# EAGLE design I2C (EAGLE 9.6.2)

## Sheet 1 of 3
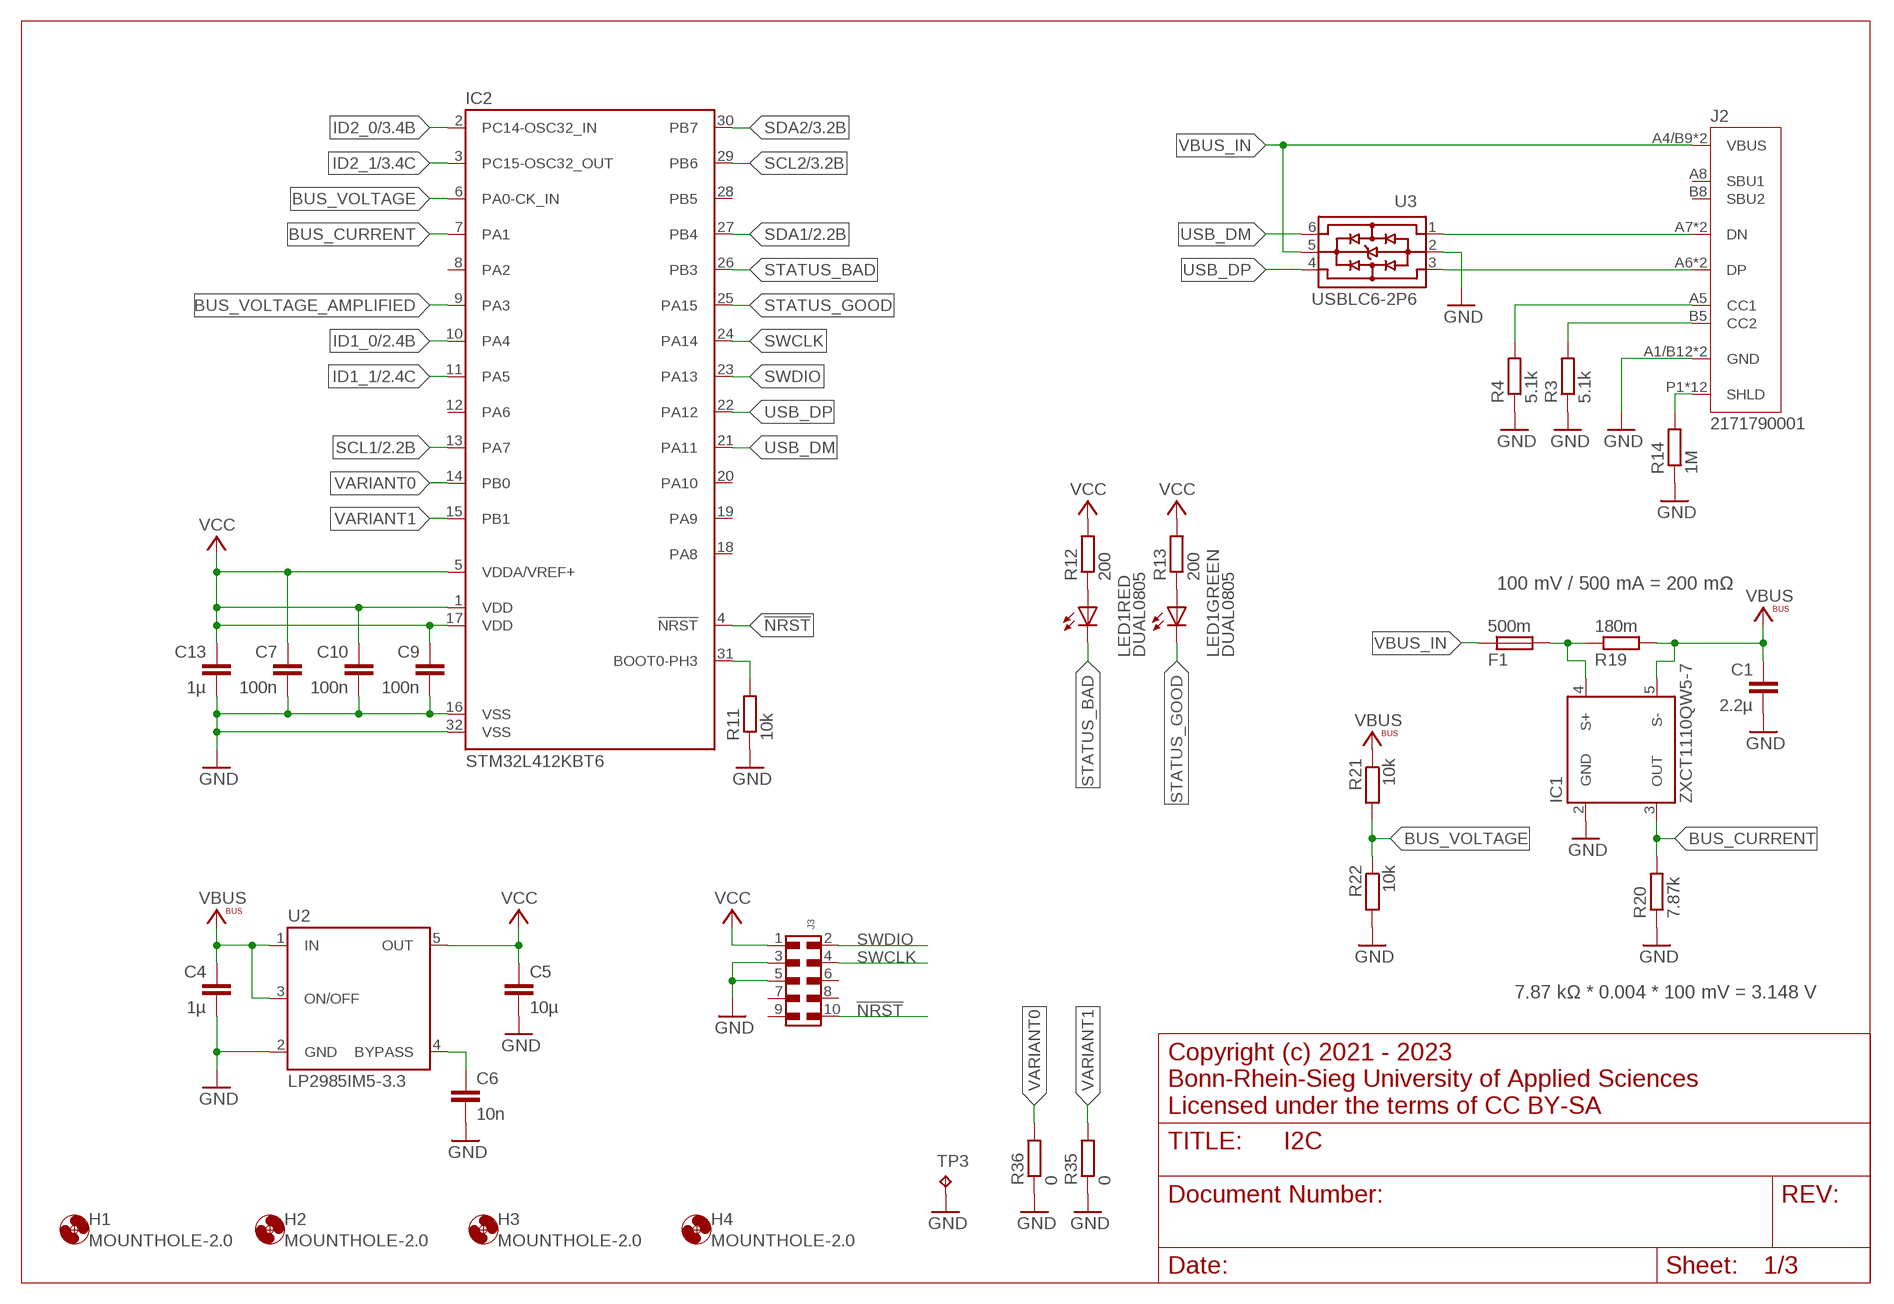
[diagram p0: schematic, sheet 1]

### Parts
C1  2.2µ  C-EUC0805  [C0805]
C4  1µ  C-EUC0805  [C0805]
C5  10µ  C-EUC0603  [C0603]
C6  10n  C-EUC0603  [C0603]
C7  100n  C-EUC0603  [C0603]
C9  100n  C-EUC0603  [C0603]
C10  100n  C-EUC0603  [C0603]
C13  1µ  C-EUC0603  [C0603]
F1  500m  FUSE0603  [R0603]
H1  MOUNTHOLE-2.0  [2.0]
H2  MOUNTHOLE-2.0  [2.0]
H3  MOUNTHOLE-2.0  [2.0]
H4  MOUNTHOLE-2.0  [2.0]
IC1  ZXCT1110QW5-7  [SOT23-5L]
IC2  STM32L412KBT6  [LQFP32]
J2  2171790001  [2171790001_MOL]
J3  6210XX21021_62101021021  [62101021021]
LED1  DUAL0805  [CHIPLEDX2]
R3  5.1k  R-EU_R0603  [R0603]
R4  5.1k  R-EU_R0603  [R0603]
R11  10k  R-EU_R0603  [R0603]
R12  200  R-EU_R0603  [R0603]
R13  200  R-EU_R0603  [R0603]
R14  1M  R-EU_R0603  [R0603]
R19  180m  R-EU_R0805  [R0805]
R20  7.87k  R-EU_R0603  [R0603]
R21  10k  R-EU_R0603  [R0603]
R22  10k  R-EU_R0603  [R0603]
R35  0  R-EU_R0603  [R0603]
R36  0  R-EU_R0603  [R0603]
TP3  TP3.8X2.03  [3.8X2.03]
U2  LP2985IM5-3.3  [SOT23-5]
U3  USBLC6-2P6  [SOT-666]

### Nets
!NRST: IC2.4(!NRST) J3.10
BUS_CURRENT: IC1.3(OUT) IC2.7(PA1) R20.2
BUS_VOLTAGE: IC2.6(PA0-CK_IN) R21.2 R22.1
BUS_VOLTAGE_AMPLIFIED: IC2.9(PA3)
GND: C1.2 C4.2 C5.2 C6.2 C7.2 C9.2 C10.2 C13.2 IC1.2(GND) IC2.16(VSS) IC2.32(VSS) J2.A1/B12(GND) J2.B1/A12(GND) J3.3 J3.5 R3.1 R4.1 R11.1 R14.1 R20.1 R22.2 R35.1 R36.1 TP3.TP U2.2(GND) U3.2 ; also sheet 2,3
ID1_0: IC2.10(PA4) ; also sheet 2
ID1_1: IC2.11(PA5) ; also sheet 2
ID2_0: IC2.2(PC14-OSC32_IN) ; also sheet 3
ID2_1: IC2.3(PC15-OSC32_OUT) ; also sheet 3
N$1: J2.P1(SHLD) J2.P2(SHLD) J2.P3(SHLD) J2.P4(SHLD) J2.S1(SHLD) J2.S2(SHLD) J2.S3(SHLD) J2.S4(SHLD) J2.S5(SHLD) J2.S6(SHLD) J2.S7(SHLD) J2.S8(SHLD) R14.2
N$4: J2.A6(DP) J2.B6(DP) U3.3
N$5: J2.A7(DN) J2.B7(DN) U3.1
N$6: J2.B5(CC2) R3.2
N$7: J2.A5(CC1) R4.2
N$8: C6.1 U2.4(BYPASS)
N$10: IC2.31(BOOT0-PH3) R11.2
N$11: LED1.A2(GREEN:A) R13.1
N$12: LED1.A1(RED:A) R12.1
N$18: F1.2 IC1.4(S+) R19.1
SCL1: IC2.13(PA7) ; also sheet 2
SCL2: IC2.29(PB6) ; also sheet 3
SDA1: IC2.27(PB4) ; also sheet 2
SDA2: IC2.30(PB7) ; also sheet 3
STATUS_BAD: IC2.26(PB3) LED1.C1(RED:C)
STATUS_GOOD: IC2.25(PA15) LED1.C2(GREEN:C)
SWCLK: IC2.24(PA14) J3.4
SWDIO: IC2.23(PA13) J3.2
USB_DM: IC2.21(PA11) U3.6
USB_DP: IC2.22(PA12) U3.4
VARIANT0: IC2.14(PB0) R36.2
VARIANT1: IC2.15(PB1) R35.2
VBUS: C1.1 C4.1 IC1.5(S-) R19.2 R21.1 U2.1(IN) U2.3(ON/OFF) ; also sheet 2,3
VBUS_IN: F1.1 J2.A4/B9(VBUS) J2.B4/A9(VBUS) U3.5
VCC: C5.1 C7.1 C9.1 C10.1 C13.1 IC2.1(VDD) IC2.5(VDDA/VREF+) IC2.17(VDD) J3.1 R12.2 R13.2 U2.5(OUT) ; also sheet 2,3
Unconnected: IC2.8(PA2) IC2.12(PA6) IC2.18(PA8) IC2.19(PA9) IC2.20(PA10) IC2.28(PB5) J2.A8(SBU1) J2.B8(SBU2) J3.6 J3.7 J3.8 J3.9

### Notes on the sheet
- 100 mV / 500 mA = 200 mΩ
- 7.87 kΩ * 0.004 * 100 mV = 3.148 V
- Copyright (c) 2021 - 2023
  Bonn-Rhein-Sieg University of Applied Sciences
  Licensed under the terms of CC BY-SA

## Sheet 2 of 3: Isolator 1
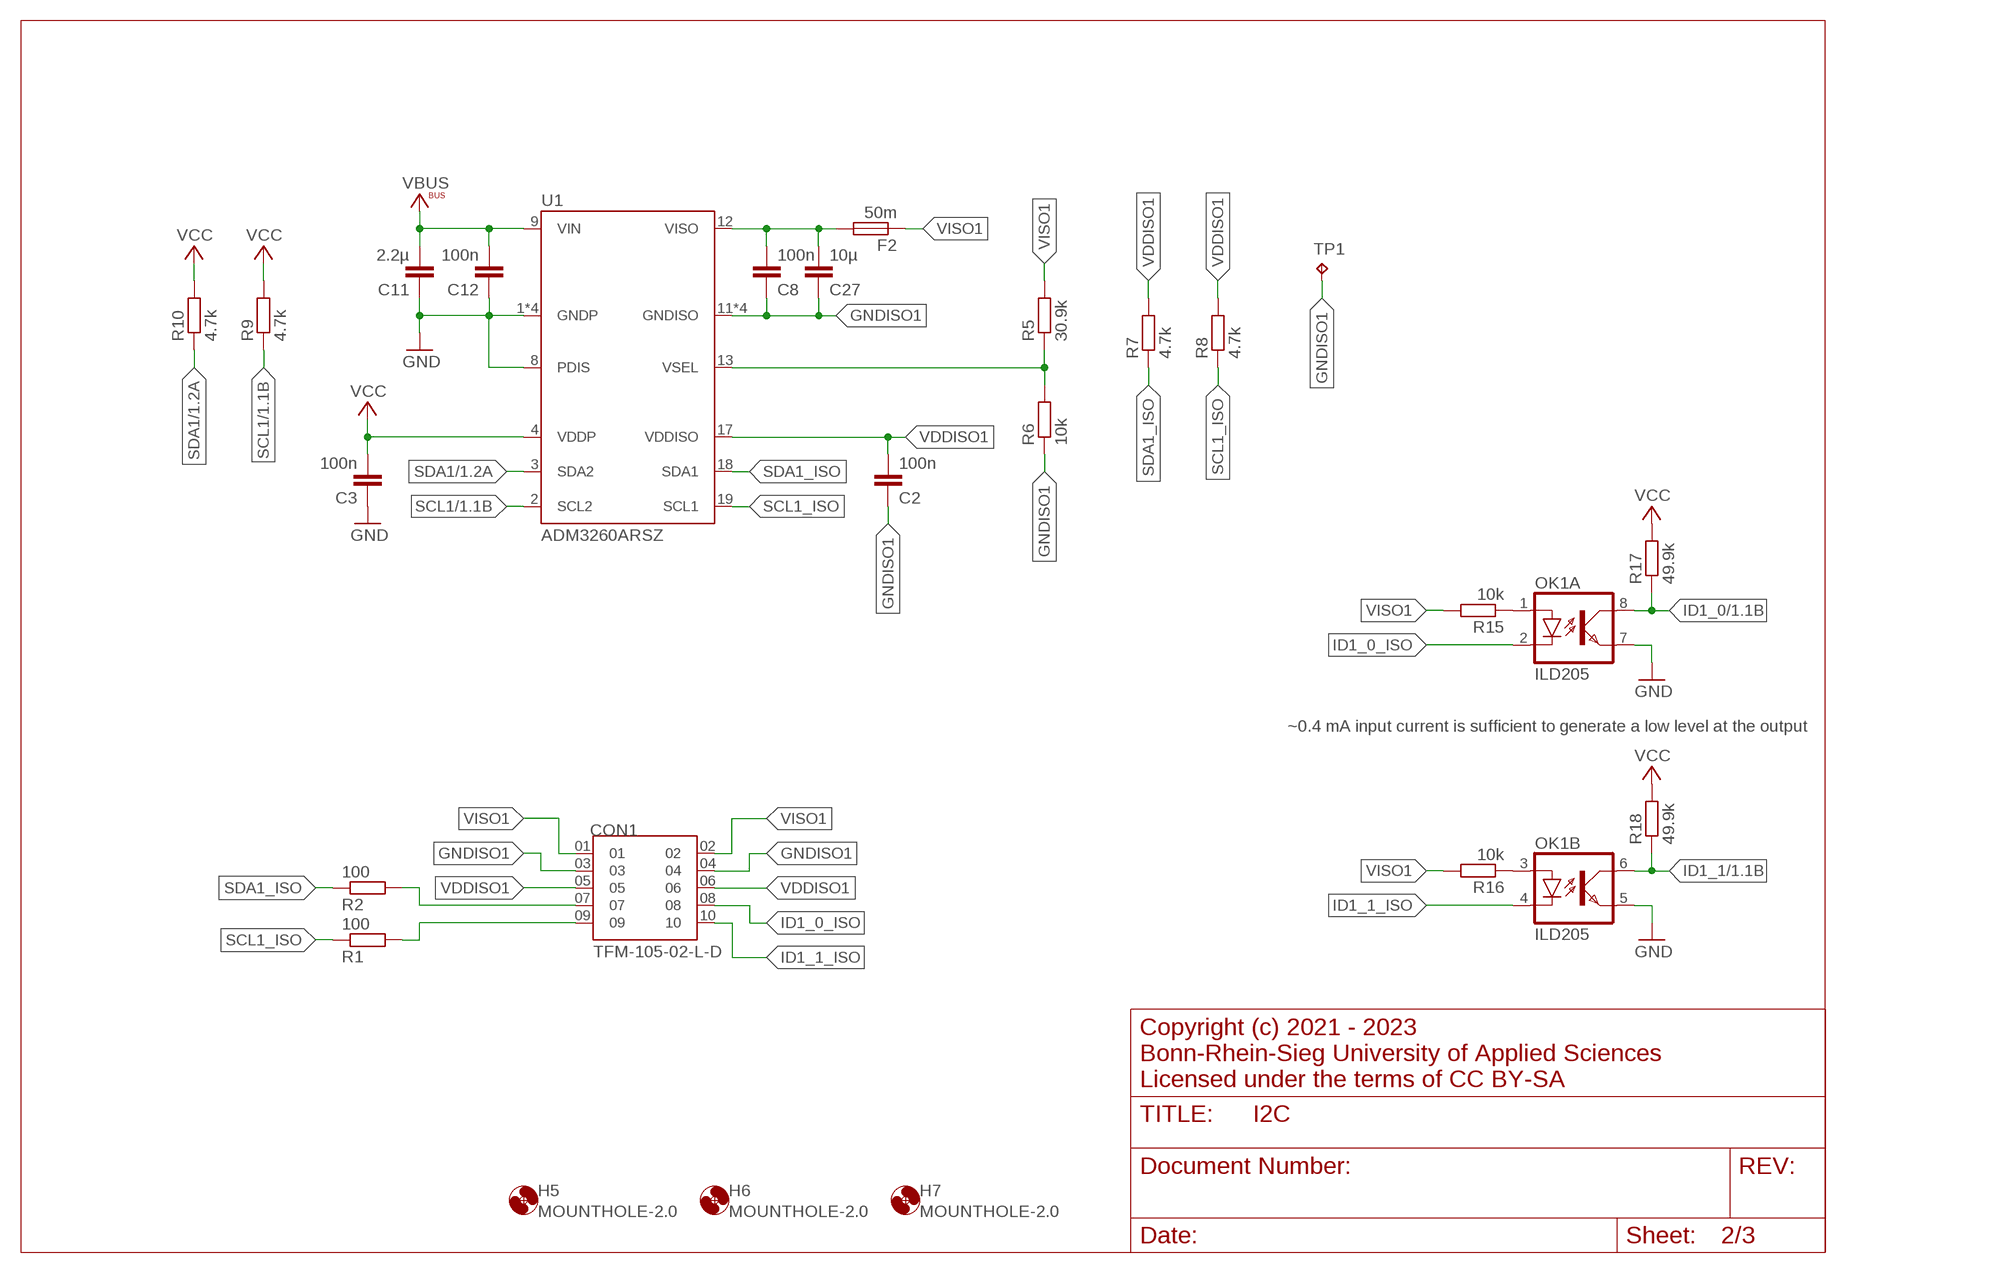
[diagram p1: schematic, sheet 2]

### Parts
C2  100n  C-EUC0603  [C0603]
C3  100n  C-EUC0603  [C0603]
C8  100n  C-EUC0603  [C0603]
C11  2.2µ  C-EUC0603  [C0603]
C12  100n  C-EUC0603  [C0603]
C27  10µ  C-EUC0603  [C0603]
CON1  TFM-105-02-L-D  [SAMTEC_TFM-105-02-L-D]
F2  50m  FUSE0603  [R0603]
H5  MOUNTHOLE-2.0  [2.0]
H6  MOUNTHOLE-2.0  [2.0]
H7  MOUNTHOLE-2.0  [2.0]
OK1  ILD205  [SOIC08]
R1  100  R-EU_R0603  [R0603]
R2  100  R-EU_R0603  [R0603]
R5  30.9k  R-EU_R0603  [R0603]
R6  10k  R-EU_R0603  [R0603]
R7  4.7k  R-EU_R0603  [R0603]
R8  4.7k  R-EU_R0603  [R0603]
R9  4.7k  R-EU_R0603  [R0603]
R10  4.7k  R-EU_R0603  [R0603]
R15  10k  R-EU_R0603  [R0603]
R16  10k  R-EU_R0603  [R0603]
R17  49.9k  R-EU_R0603  [R0603]
R18  49.9k  R-EU_R0603  [R0603]
TP1  TP3.8X2.03  [3.8X2.03]
U1  ADM3260ARSZ  [SSOP20]

### Nets
GND: C3.1 C11.1 C12.1 OK1.5(B:EMIT) OK1.7(A:EMIT) U1.1(GNDP) U1.5(GNDP) U1.7(GNDP) U1.8(PDIS) U1.10(GNDP) ; also sheet 1,3
GNDISO1: C2.1 C8.1 C27.1 CON1.03 CON1.04 R6.1 TP1.TP U1.11(GNDISO) U1.14(GNDISO) U1.16(GNDISO) U1.20(GNDISO)
ID1_0: OK1.8(A:COL) R17.1 ; also sheet 1
ID1_0_ISO: CON1.08 OK1.2(A:C)
ID1_1: OK1.6(B:COL) R18.1 ; also sheet 1
ID1_1_ISO: CON1.10 OK1.4(B:C)
N$3: CON1.09 R1.2
N$9: R5.1 R6.2 U1.13(VSEL)
N$13: CON1.07 R2.2
N$14: OK1.3(B:A) R16.1
N$15: OK1.1(A:A) R15.1
N$16: C8.2 C27.2 F2.2 U1.12(VISO)
SCL1: R9.1 U1.2(SCL2) ; also sheet 1
SCL1_ISO: R1.1 R8.1 U1.19(SCL1)
SDA1: R10.1 U1.3(SDA2) ; also sheet 1
SDA1_ISO: R2.1 R7.1 U1.18(SDA1)
VBUS: C11.2 C12.2 U1.9(VIN) ; also sheet 1,3
VCC: C3.2 R9.2 R10.2 R17.2 R18.2 U1.4(VDDP) ; also sheet 1,3
VDDISO1: C2.2 CON1.05 CON1.06 R7.2 R8.2 U1.17(VDDISO)
VISO1: CON1.01 CON1.02 F2.1 R5.2 R15.2 R16.2

### Notes on the sheet
- ~0.4 mA input current is sufficient to generate a low level at the output
- Copyright (c) 2021 - 2023
  Bonn-Rhein-Sieg University of Applied Sciences
  Licensed under the terms of CC BY-SA

## Sheet 3 of 3: Isolator 2
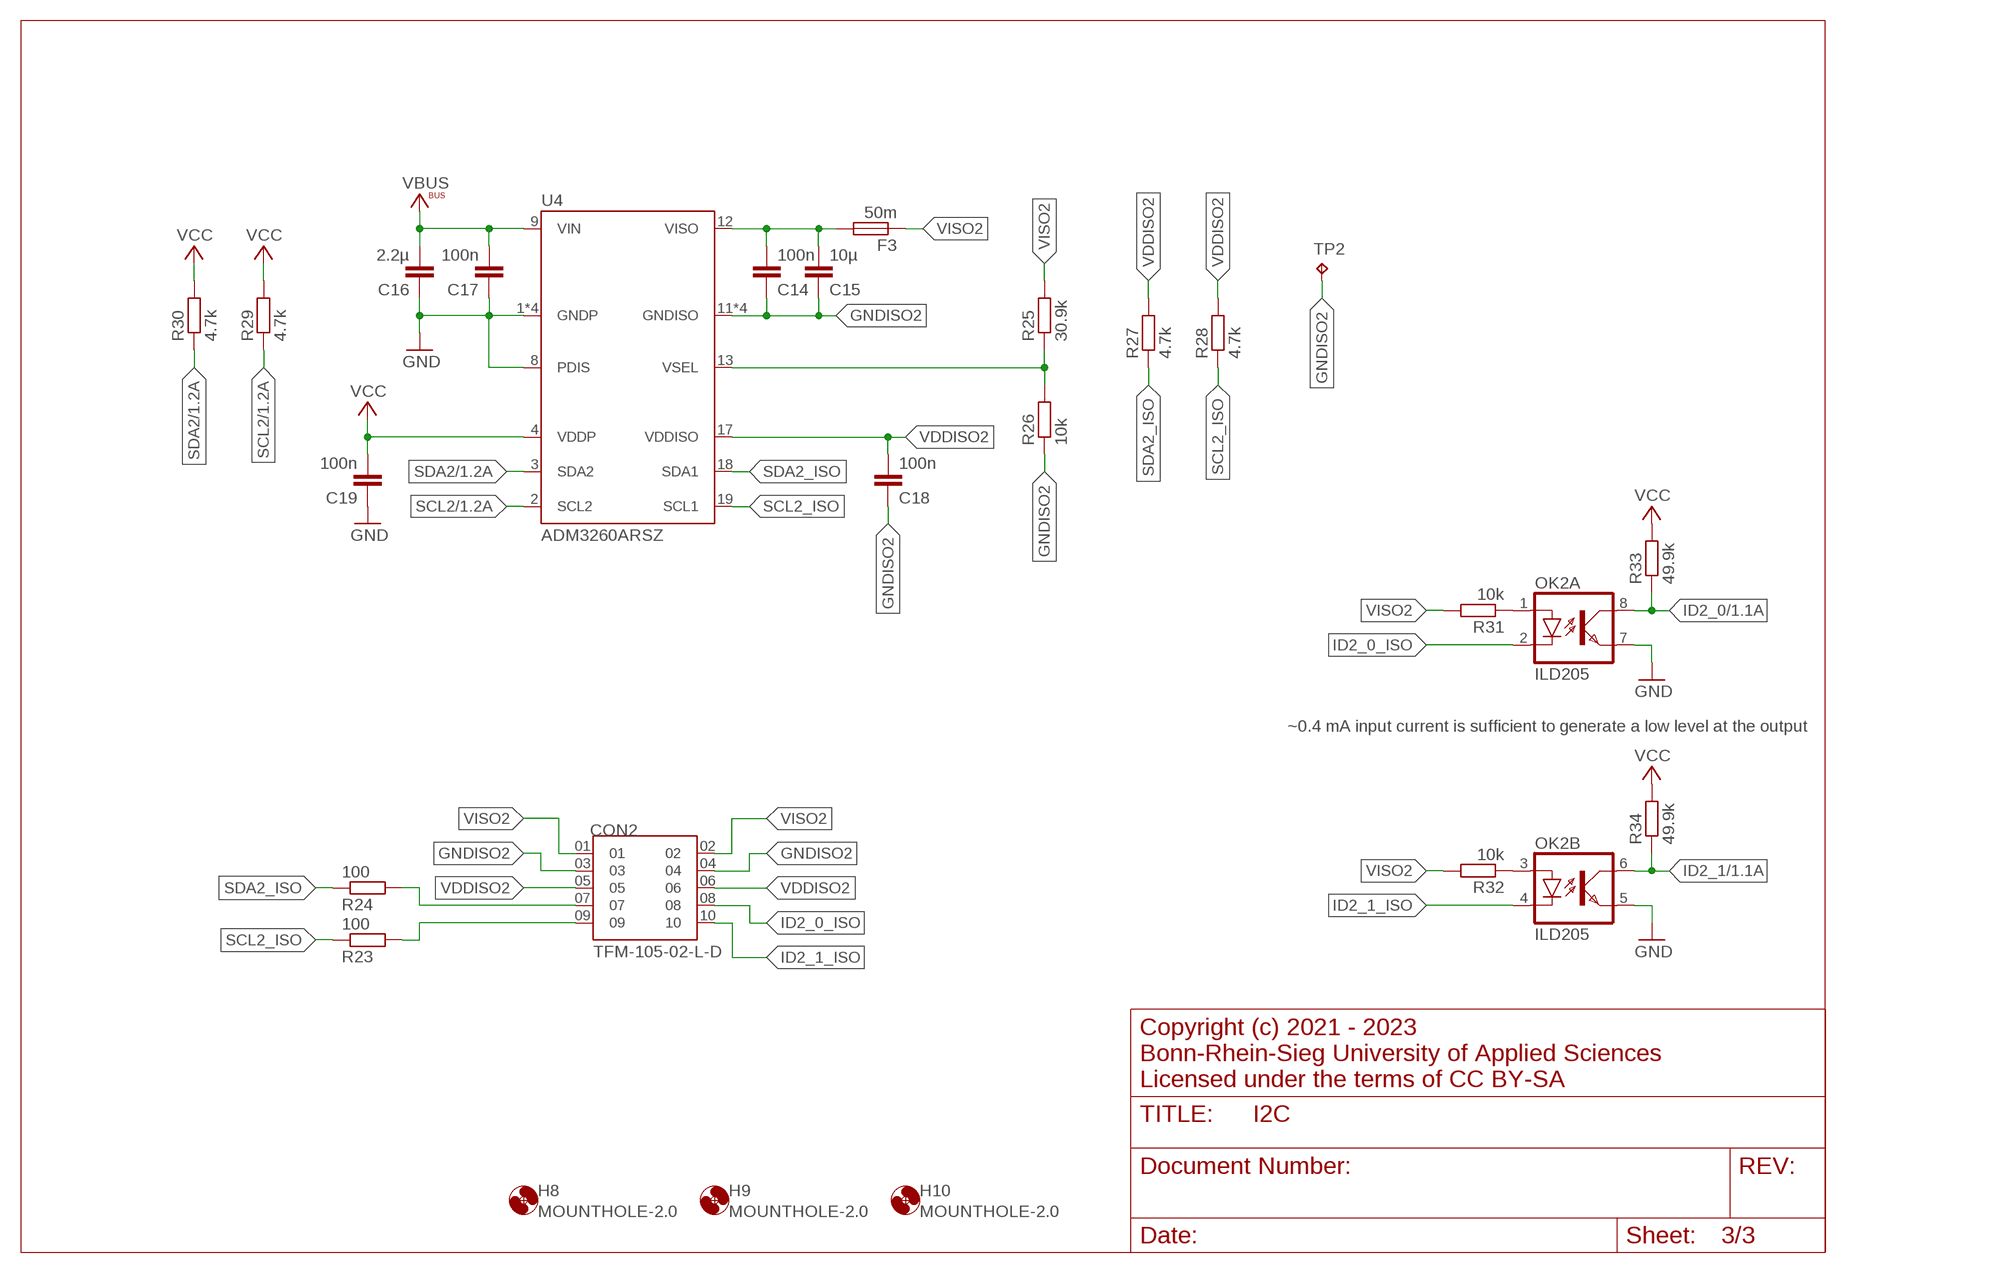
[diagram p2: schematic, sheet 3]

### Parts
C14  100n  C-EUC0603  [C0603]
C15  10µ  C-EUC0603  [C0603]
C16  2.2µ  C-EUC0603  [C0603]
C17  100n  C-EUC0603  [C0603]
C18  100n  C-EUC0603  [C0603]
C19  100n  C-EUC0603  [C0603]
CON2  TFM-105-02-L-D  [SAMTEC_TFM-105-02-L-D]
F3  50m  FUSE0603  [R0603]
H8  MOUNTHOLE-2.0  [2.0]
H9  MOUNTHOLE-2.0  [2.0]
H10  MOUNTHOLE-2.0  [2.0]
OK2  ILD205  [SOIC08]
R23  100  R-EU_R0603  [R0603]
R24  100  R-EU_R0603  [R0603]
R25  30.9k  R-EU_R0603  [R0603]
R26  10k  R-EU_R0603  [R0603]
R27  4.7k  R-EU_R0603  [R0603]
R28  4.7k  R-EU_R0603  [R0603]
R29  4.7k  R-EU_R0603  [R0603]
R30  4.7k  R-EU_R0603  [R0603]
R31  10k  R-EU_R0603  [R0603]
R32  10k  R-EU_R0603  [R0603]
R33  49.9k  R-EU_R0603  [R0603]
R34  49.9k  R-EU_R0603  [R0603]
TP2  TP3.8X2.03  [3.8X2.03]
U4  ADM3260ARSZ  [SSOP20]

### Nets
GND: C16.1 C17.1 C19.1 OK2.5(B:EMIT) OK2.7(A:EMIT) U4.1(GNDP) U4.5(GNDP) U4.7(GNDP) U4.8(PDIS) U4.10(GNDP) ; also sheet 1,2
GNDISO2: C14.1 C15.1 C18.1 CON2.03 CON2.04 R26.1 TP2.TP U4.11(GNDISO) U4.14(GNDISO) U4.16(GNDISO) U4.20(GNDISO)
ID2_0: OK2.8(A:COL) R33.1 ; also sheet 1
ID2_0_ISO: CON2.08 OK2.2(A:C)
ID2_1: OK2.6(B:COL) R34.1 ; also sheet 1
ID2_1_ISO: CON2.10 OK2.4(B:C)
N$2: R25.1 R26.2 U4.13(VSEL)
N$17: CON2.09 R23.2
N$19: CON2.07 R24.2
N$20: OK2.3(B:A) R32.1
N$21: OK2.1(A:A) R31.1
N$22: C14.2 C15.2 F3.2 U4.12(VISO)
SCL2: R29.1 U4.2(SCL2) ; also sheet 1
SCL2_ISO: R23.1 R28.1 U4.19(SCL1)
SDA2: R30.1 U4.3(SDA2) ; also sheet 1
SDA2_ISO: R24.1 R27.1 U4.18(SDA1)
VBUS: C16.2 C17.2 U4.9(VIN) ; also sheet 1,2
VCC: C19.2 R29.2 R30.2 R33.2 R34.2 U4.4(VDDP) ; also sheet 1,2
VDDISO2: C18.2 CON2.05 CON2.06 R27.2 R28.2 U4.17(VDDISO)
VISO2: CON2.01 CON2.02 F3.1 R25.2 R31.2 R32.2

### Notes on the sheet
- ~0.4 mA input current is sufficient to generate a low level at the output
- Copyright (c) 2021 - 2023
  Bonn-Rhein-Sieg University of Applied Sciences
  Licensed under the terms of CC BY-SA

## Library data of the parts
C1 C4-C6 = rcl:C-EU: CAPACITOR, European symbol; SPICEPREFIX: C
C2 C3 C7-C19 C27 = rcl:C-EU: CAPACITOR, European symbol
CON1 CON2 = TFM-10x-02-L-D:TFM-105-02-L-D
F1-F3 = Fuse0603:FUSE: Surface mount fuse
H1-H10 = MountHoles:MOUNTHOLE-2.0
IC1 = ZXCT11xx:ZXCT1110: LOW POWER HIGH-SIDE CURRENT MONITORS
IC2 = STM32:STM32L412K*?: Ultra-low-power ARM Cortex-M4 32-bit MCU+FPU, 100DMIPS, up to 128KB Flash, 40KB SRAM, analog, ext. SMPS
J2 = USB-C:2171790001; COPYRIGHT: Copyright (C) 2021 Ultra Librarian. All rights reserved.; DIGI-KEY_PART_NUMBER_1: 900-2171790001TR-ND; DIGI-KEY_PART_NUMBER_2: 900-2171790001CT-ND; DIGI-KEY_PART_NUMBER_3: 900-2171790001DKR-ND; MANUFACTURER_PART_NUMBER: 2171790001; MFR_NAME: Molex Connector Corporation
J3 = WR-PHD:6210XX21021_62101021021: WR-PHD 1.27 mm SMT Dual Pin Header, H=3.80 mm ARTICLE PROPERTIES: Pins:4;​ 8;​ 10;​ 14;​ 16;​ 20;​ 28;​ 40;​ 44;​ 50 KIND PROPERTIES: Pitch：1.27 mm Quality Class:3 as per CECC 75 301-802 Rows：Dual Gender：Pin Header Type：Straight MATERIAL PROPERTIES: Insulator Material :PA9T Insulator Flammability Rating:UL94 V-0 Contact Material:Copper Alloy Contact Plating:Gold Contact Type:Stamped GENERAL INFORMATION Operating Temperature:-40 up to +105 °C Compliance:Lead free / RoHS ELECTRICAL PROPERTIES: Rated Current:1 A;​ max. IR1:1 A Withstanding Voltage:500 V (AC) Contact Resistance:20 mΩ RISO:1000 MΩ CERTIFICATION UL Approval:E323964 PACKAGING PROPERTIES Packaging:Tube Packaging Unit:228;​ 114;​ 91;​ 65;​ 57;​ 45;​ 32;​ 23;​ 20;​ 18 <https://katalog.we-online.com/media/images/v2/o33195v209%20Family_WR-PDH_621xxx21021.jpg> Details see: https://katalog.we-online.com/en/em/PHD_1_27_SMT_DUAL_PIN_HEADER_6210XX21021 Updated by Yingchun,Shan 2019-10-25 2019 (C) Würth Elektronik; DATASHEET-URL: https://katalog.we-online.com/em/datasheet/62101021021.pdf; GENDER: Pin Header; IR: 1A; MATES: WR-PHD 1.27mm Dual Socket Header/SMT Dual Socket Header,H=4.5mm/SMT Dual Socket Header,H=4.5mm(Reel); PACKAGING: Tube; PART-NUMBER: 62101021021; PINS: 10; ROWS: Dual; TYPE: Straight
LED1 = DualLED:DUAL0805: Kingbright APHBM2012SURKCGKC (www.digikey.de/product-detail/de/kingbright/APHBM2012SURKCGKC/754-1093-1-ND/1747810)
OK1 OK2 = optocoupler:ILD2*: Siemens ILD205/206/207/211/213/217 DUAL PHOTOTRANSISTOR SMALL OUTLINE SURFACE MOUNT OPTOCOUPLER Source: 153385-da-01-en-Optocoupler_ILD205-T.pdf; MF: VISHAY/TELEFUNKEN; MPN: ILD205T; OC_FARNELL: 1469512; OC_NEWARK: 20H8678
R1-R34 = rcl:R-EU_: RESISTOR, European symbol; SPICEPREFIX: R
R35 R36 = rcl:R-EU_: RESISTOR, European symbol
TP1-TP3 = Testpoints:TP: KEYSTONE SURFACE MOUNT TEST POINTS
U1 U4 = ADM3260:ADM3260: Hot Swappable, Dual I2C Isolators with Integrated DC-to-DC Converter
U2 = LP2985:LP2985?-*: LP2985-N Micropower 150-mA Low-Noise Ultra-Low-Dropout Regulator in a SOT-23 Package Designed for Use With Very Low ESR Output Capacitors
U3 = USBLC6-2:USBLC6-2: Very low capacitance ESD protection

## Board
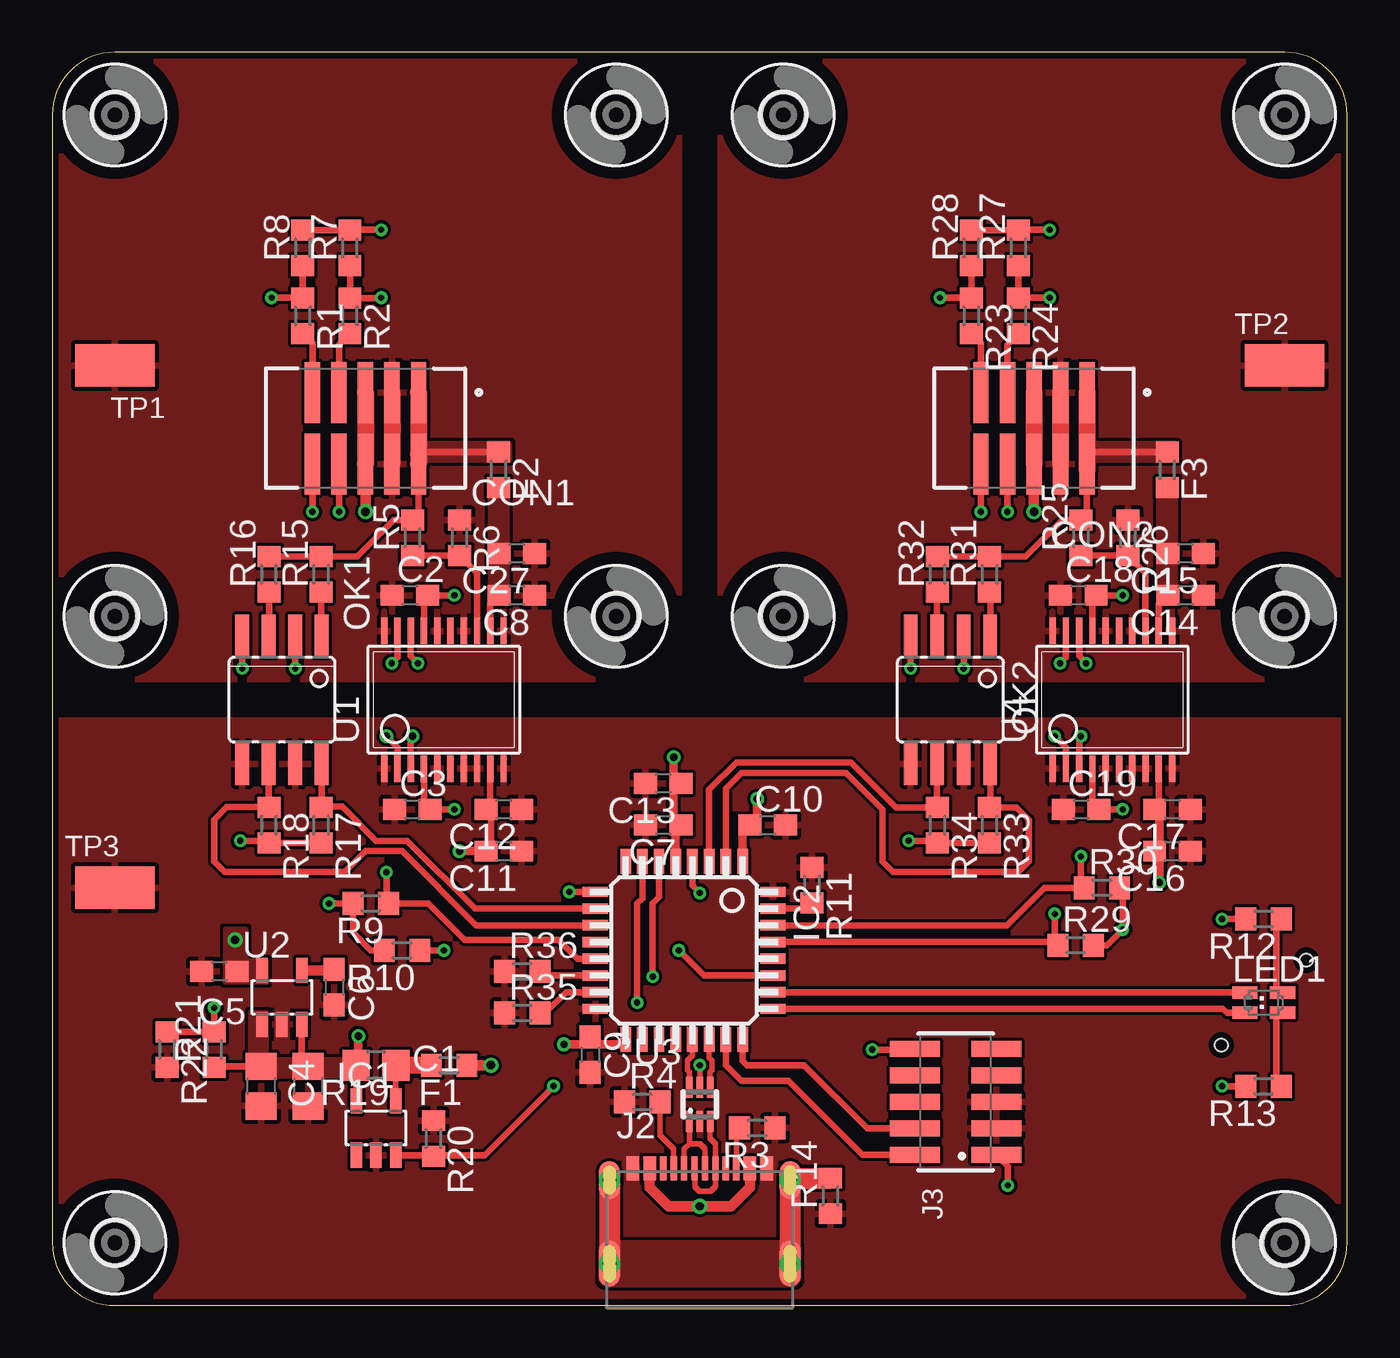
[diagram p3: board, top side]
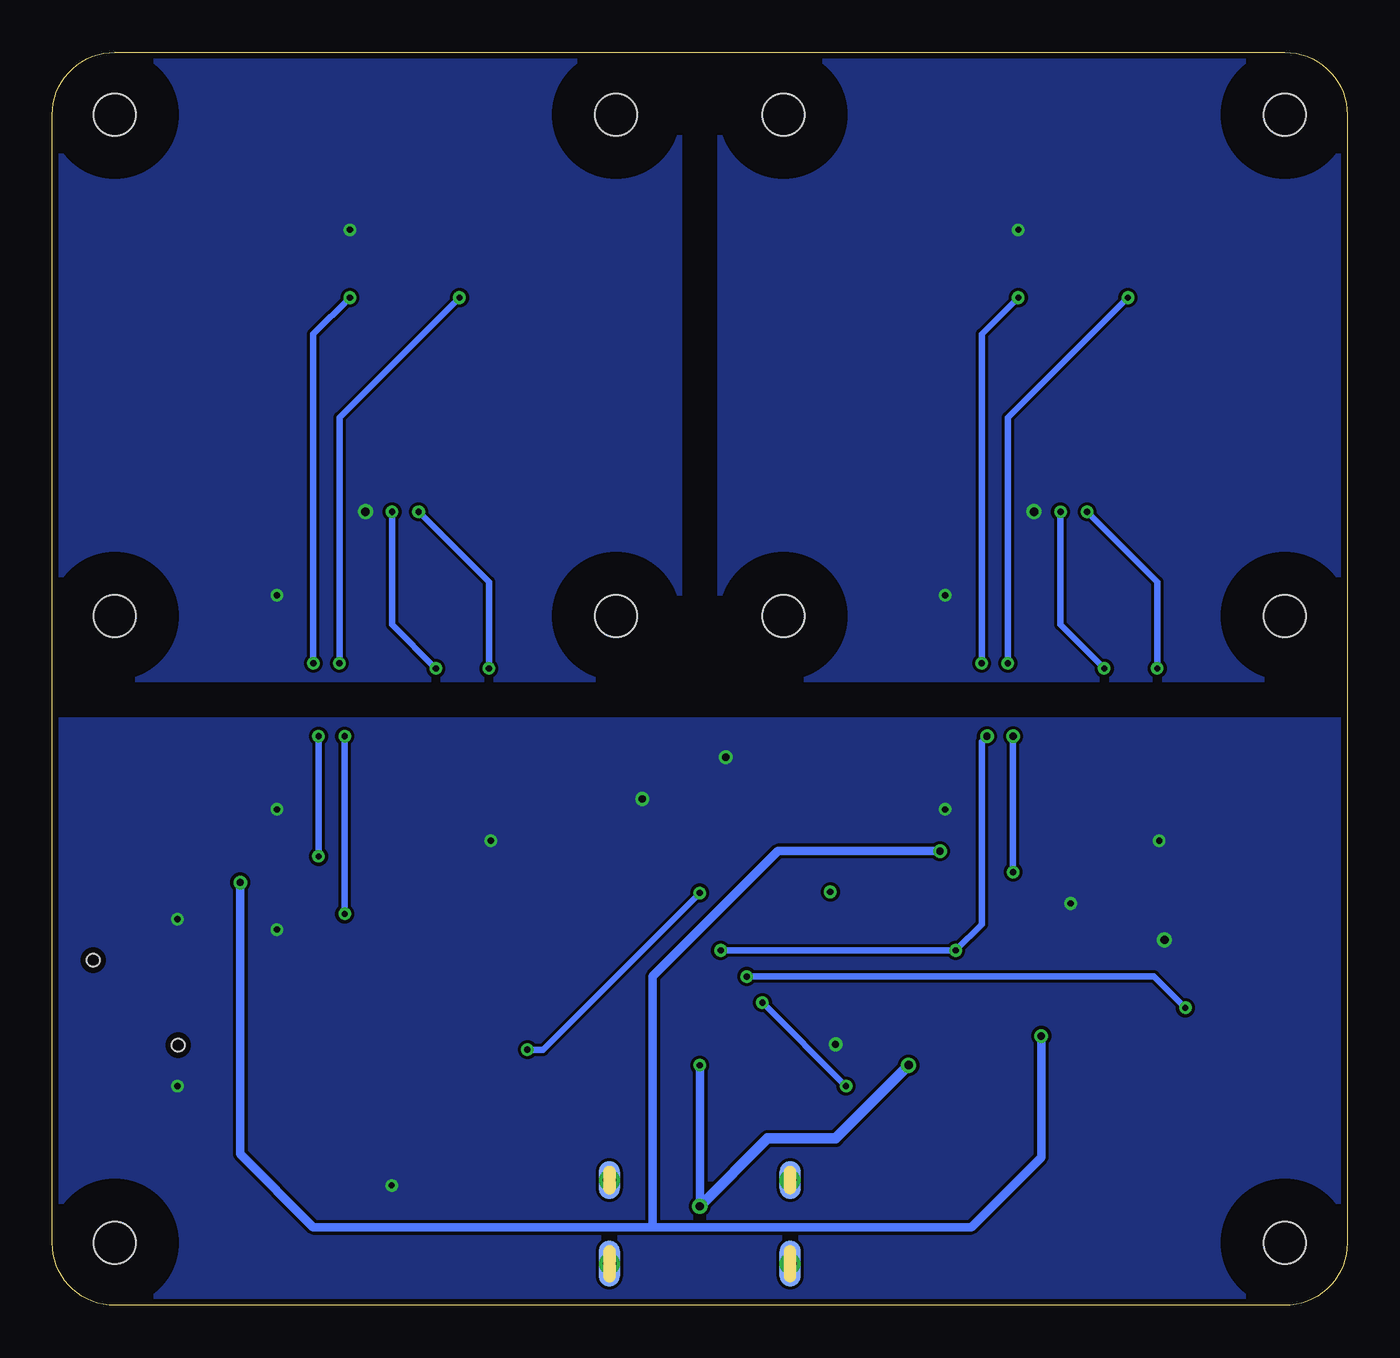
[diagram p4: board, bottom side, seen from below]

Size 62 x 60 mm. Coordinates in mm from the lower left corner, seen from the top.
Outline: 0,3 arc90 3,0 59,0 arc90 62,3 62,57 arc90 59,60 3,60 arc90 0,57 0,3
Copper layers (1*16): Top 0.035mm / dielectric 1.5mm / Bottom 0.035mm
Design rules "PCB-POOL Standard": minimum track width 0.15mm, minimum drill 0.3mm, track to track 0.15mm, track to pad 0.15mm, pad to pad 0.15mm, via to via 0.15mm, smd to smd 0.15mm, copper to edge 0.3mm, drill to drill 0.2mm, minimum pad ring 0.2mm, minimum via ring 0.15mm, stop-mask expansion 0.075mm, vias tented up to drill 0mil, thermal gap 0.2mm
Holes 0.61 mm at 60.03,16.53 55.97,12.47

### Footprints (pad centres in the part's own frame; a part is rotated, then mirrored left to right if it is on the bottom)
C0805 = smd 1.3 x 1.5: 1 -0.95,0; 2 0.95,0
C0603 = smd 1.1 x 1: 1 -0.85,0; 2 0.85,0
SAMTEC_TFM-105-02-L-D = smd 0.74 x 2.92: 01 -2.54,-1.715; 02 -2.54,1.715; 03 -1.27,-1.715; 04 -1.27,1.715; 05 0,-1.715; 06 0,1.715; 07 1.27,-1.715; 08 1.27,1.715; 09 2.54,-1.715; 10 2.54,1.715
R0603 = smd 1 x 1.1: 1 -0.85,0; 2 0.85,0
2.0 = hole 2: 0,0
SOT23-5L = smd 0.55 x 1.2: 1 -0.95,-1.3; 2 0,-1.3; 3 0.95,-1.3; 4 0.95,1.3; 5 -0.95,1.3
LQFP32 = smd 0.5 x 1.2: 1 -2.8,-4.25; 2 -2,-4.25; 3 -1.2,-4.25; 4 -0.4,-4.25; 5 0.4,-4.25; 6 1.2,-4.25; 7 2,-4.25; 8 2.8,-4.25; 17 2.8,4.25; 18 2,4.25; 19 1.2,4.25; 20 0.4,4.25; 21 -0.4,4.25; 22 -1.2,4.25; 23 -2,4.25; 24 -2.8,4.25 | smd 1.2 x 0.5: 9 4.25,-2.8; 10 4.25,-2; 11 4.25,-1.2; 12 4.25,-0.4; 13 4.25,0.4; 14 4.25,1.2; 15 4.25,2; 16 4.25,2.8; 25 -4.25,2.8; 26 -4.25,2; 27 -4.25,1.2; 28 -4.25,0.4; 29 -4.25,-0.4; 30 -4.25,-1.2; 31 -4.25,-2; 32 -4.25,-2.8
2171790001_MOL = smd 0.6 x 1.15: A1/B12 -3.2,2.575; A4/B9 -2.4,2.575; B1/A12 3.2,2.575; B4/A9 2.4,2.575 | smd 0.3 x 1.15: A5 -1.25,2.575; A6 -0.25,2.575; A7 0.25,2.575; A8 1.25,2.575; B5 1.75,2.575; B6 0.75,2.575; B7 -0.75,2.575; B8 -1.75,2.575 | drill 0.6 pad 1: P1 -4.32,2; P2 4.32,2; P3 -4.32,-2; P4 4.32,-2 | smd 1 x 1.8: S1 -4.32,2; S2 4.32,2 | smd 1 x 2.2: S3 -4.32,-2; S4 4.32,-2 | smd 1 x 2.2 bottom: S5 -4.32,-2; S6 4.32,-2 | smd 1 x 1.8 bottom: S7 4.32,2; S8 -4.32,2
62101021021 = smd 0.75 x 2.4: 1 -2.54,-1.95; 2 -2.54,1.95; 3 -1.27,-1.95; 4 -1.27,1.95; 5 0,-1.95; 6 0,1.95; 7 1.27,-1.95; 8 1.27,1.95; 9 2.54,-1.95; 10 2.54,1.95
CHIPLEDX2 = smd 0.6 x 1.2: A1 -0.475,0.9; A2 0.475,0.9; C1 -0.475,-0.9; C2 0.475,-0.9
SOIC08 = smd 0.66 x 2.032: 1 -1.905,-3.073; 2 -0.635,-3.073; 3 0.635,-3.073; 4 1.905,-3.073; 5 1.905,3.073; 6 0.635,3.073; 7 -0.635,3.073; 8 -1.905,3.073
R0805 = smd 1.3 x 1.5: 1 -0.95,0; 2 0.95,0
3.8X2.03 = smd 3.8 x 2.03: TP 0,0
SSOP20 = smd 0.305 x 1.245: 1 -2.857,-3.302; 2 -2.222,-3.302; 3 -1.587,-3.302; 4 -0.952,-3.302; 5 -0.317,-3.302; 6 0.318,-3.302; 7 0.953,-3.302; 8 1.588,-3.302; 9 2.223,-3.302; 10 2.858,-3.302; 11 2.858,3.302; 12 2.223,3.302; 13 1.588,3.302; 14 0.953,3.302; 15 0.318,3.302; 16 -0.317,3.302; 17 -0.952,3.302; 18 -1.587,3.302; 19 -2.222,3.302; 20 -2.857,3.302
SOT23-5 = smd 0.55 x 1.2: 1 -0.95,-1.3; 2 0,-1.3; 3 0.95,-1.3; 4 0.95,1.3; 5 -0.95,1.3
SOT-666 = smd 0.3 x 1: 1 -0.5,-0.81; 2 0,-0.81; 3 0.5,-0.81; 4 0.5,0.81; 5 0,0.81; 6 -0.5,0.81

### Placement (x,y rotation side)
C1  12.25,10.5 270 top
C2  17.12,34 0 top
C3  17.25,23.75 0 top
C4  10,10.5 270 top
C5  8,16 180 top
C6  13.5,15.25 270 top
C7  29.25,23 180 top
C8  22.25,34 180 top
C9  25.75,12 270 top
C10  34.25,23 0 top
C11  21.62,21.75 180 top
C12  21.62,23.75 180 top
C13  29.25,25 180 top
C14  54.25,34 180 top
C15  54.25,36 180 top
C16  53.62,21.75 180 top
C17  53.62,23.75 180 top
C18  49.12,34 0 top
C19  49.25,23.75 0 top
C27  22.25,36 180 top
CON1  15,42 180 top
CON2  47,42 180 top
F1  19,11.5 180 top
F2  21.38,40 270 top
F3  53.38,40 270 top
H1  3,3 0 top
H2  59,3 0 top
H3  59,57 0 top
H4  3,57 0 top
H5  3,33 0 top
H6  27,57 0 top
H7  27,33 0 top
H8  35,33 0 top
H9  59,33 0 top
H10  35,57 0 top
IC1  15.5,8.5 0 top
IC2  30.25,17 180 top
J2  31,4 0 top
J3  43.25,9.75 90 top
LED1  58,14.5 270 top
OK1  11,29 180 top
OK2  43,29 180 top
R1  12,47.38 270 top
R2  14.25,47.38 270 top
R3  33.75,8.5 180 top
R4  28.25,9.75 0 top
R5  17.25,36.75 90 top
R6  19.5,36.75 270 top
R7  14.25,50.62 90 top
R8  12,50.62 90 top
R9  15.25,19.25 180 top
R10  16.75,17 180 top
R11  36.38,20.12 270 top
R12  58,18.5 180 top
R13  58,10.5 180 top
R14  37.25,5.25 90 top
R15  12.88,35 90 top
R16  10.38,35 90 top
R17  12.88,23 270 top
R18  10.38,23 270 top
R19  15.5,11.5 180 top
R20  18.25,8 270 top
R21  7.75,12.25 90 top
R22  5.5,12.25 270 top
R23  44,47.38 270 top
R24  46.25,47.38 270 top
R25  49.25,36.75 90 top
R26  51.5,36.75 270 top
R27  46.25,50.62 90 top
R28  44,50.62 90 top
R29  49,17.25 0 top
R30  50.25,20 0 top
R31  44.88,35 90 top
R32  42.38,35 90 top
R33  44.88,23 270 top
R34  42.38,23 270 top
R35  22.5,14 0 top
R36  22.5,16 0 top
TP1  3,45 180 top
TP2  59,45 0 top
TP3  3,20 0 top
U1  18.75,29 0 top
U2  11,14.75 0 top
U3  31,9.62 0 top
U4  50.75,29 0 top

### Tracks (layer width: path | path; a pad name or v marks a point on that pad's centre or on a via)
!NRST  (via drill 0.3)
  Top 0.305: IC2.4 30.65,20.1 v31,19.75 | v39.25,12.25 41.26,12.25 J3.10
  Bottom 0.305: v39.25,12.25 38.5,12.25 v31,19.75
BUS_CURRENT  (via drill 0.3)
  Top 0.305: IC1.3 18.2,7.2 | 18.2,7.2 R20.2 | IC2.7 28.25,19.5 28,19.25 v28,14.5 | v24,10.5 20.7,7.2 18.2,7.2
  Bottom 0.305: v28,14.5 v24,10.5
BUS_VOLTAGE  (via drill 0.3)
  Top 0.305: R22.1 R21.2 v7.75,14.25 | IC2.6 29.05,19.55 28.75,19.25 v28.75,15.75
  Bottom 0.305: v7.75,14.25 9.25,15.75 v28.75,15.75
BUS_VOLTAGE_AMPLIFIED  (via drill 0.3)
  Top 0.305: IC2.9 24.8,19.8 v24.75,19.8
GND
  pour Top (rank 2): 0,3 0,28 62,28 62,3 arc-90 59,0 3,0 arc-90
  pour Top (no thermals): 10.75,12.5 11.25,12.5 11.25,14.5 12.75,14.5 12.75,15 9.25,15 9.25,14.5 10.75,14.5
  pour Top (no thermals): 30.12,9.75 31.88,9.75 31.88,9.25 31.12,9.25 31.12,8.88 30.88,8.88 30.88,9.25 30.12,9.25
  pour Top (no thermals): 28,5.62 28,7.5 27.38,7.5 27.38,5.62
  pour Top (no thermals): 34.62,5.62 34.62,7.5 34,7.5 34,5.62
GNDISO1
  Top 0.813: CON1.03 CON1.04
  pour Top (rank 2): 0,57 arc-90 3,60 30,60 30,30 0,30
GNDISO2
  Top 0.813: CON2.03 CON2.04
  pour Top (rank 2): 32,30 62,30 62,57 arc90 59,60 32,60
ID1_0
  Top 0.305: OK1.8 12.9,23.88 | 12.9,23.88 R17.1 | IC2.10 20.25,19 17,22.25 15.5,22.25 13.87,23.88 12.9,23.88
ID1_0_ISO  (via drill 0.3)
  Top 0.305: CON1.08 v13.73,38 | OK1.2 v11.63,30.5
  Bottom 0.305: v11.63,30.5 13.73,32.59 v13.73,38
ID1_1
  Top 0.305: OK1.6 10.37,23.86 | 10.37,23.86 R18.1 | IC2.11 20.3,18.2 16.75,21.75 15,21.75 14,20.75 8.25,20.75 7.75,21.25 7.75,23.25 8.36,23.86 10.37,23.86
ID1_1_ISO  (via drill 0.3)
  Top 0.305: OK1.4 v9.1,30.5 | CON1.10 v12.46,38
  Bottom 0.305: v9.1,30.5 9.1,34.63 v12.46,38
ID2_0
  Top 0.305: OK2.8 44.91,23.88 R33.1 46.15,23.85 46.75,23.25 46.75,21.25 46.25,20.75 40.25,20.75 39.75,21.25 39.75,23.75 38,25.5 33,25.5 32.25,24.75 IC2.2
ID2_0_ISO  (via drill 0.3)
  Top 0.305: OK2.2 v43.63,30.5 | CON2.08 v45.73,38
  Bottom 0.305: v43.63,30.5 45.73,32.59 v45.73,38
ID2_1
  Top 0.305: OK2.6 42.37,23.86 R34.1 40.4,23.85 38.25,26 32.75,26 31.45,24.7 IC2.3
ID2_1_ISO  (via drill 0.3)
  Top 0.305: OK2.4 v41.09,30.5 | CON2.10 v44.46,38
  Bottom 0.305: v41.09,30.5 41.09,34.63 v44.46,38
N$1
  Top 1.016: J2.S8 J2.S5 | J2.S6 J2.S7 35.42,6.1 R14.2
  pour Top (no thermals): 26.62,1.38 35.38,1.38 35.38,2.62 26.62,2.62
N$2
  Top 0.305: R25.1 R26.2 52.34,35.06 U4.13
N$3
  Top 0.305: CON1.09 12.46,46.06 R1.2
N$4
  Top 0.254: U3.3 31.5,8 31.75,7.75 J2.B6 31.75,5.71 31.52,5.47 30.98,5.47 30.77,5.68 30.77,6.55 J2.A6
N$5
  Top 0.254: U3.1 30.5,7.75 | 30.5,7.75 30.25,7.5 J2.B7 | J2.A7 31.25,7.5 31,7.75 30.5,7.75
N$6
  Top 0.254: J2.B5 32.75,8.35 R3.2
N$7
  Top 0.254: J2.A5 29.75,7.5 29.1,8.15 R4.2
N$8
  Top 0.508: U2.4 13.45,16.05 C6.1
N$9
  Top 0.305: R5.1 R6.2 20.34,35.06 U1.13
N$10
  Top 0.305: IC2.31 36.1,19 R11.2
N$11
  Top 0.305: LED1.A2 58.6,13.72 58.6,10.75 R13.1
N$12
  Top 0.305: LED1.A1 58.6,15.28 58.6,18.25 R12.1
N$13
  Top 0.305: CON1.07 13.73,46.01 R2.2
N$14
  Top 0.305: R16.1 10.38,32.08 OK1.3
N$15
  Top 0.305: R15.1 12.88,32.1 OK1.1
N$16
  Top 0.305: U1.12 20.97,33.57 C8.2
  pour Top (no thermals): 21,33.75 21.75,33.75 21.75,39.5 21,39.5
N$17
  Top 0.305: CON2.09 44.46,46.06 R23.2
N$18
  Top 0.254: IC1.4 R19.1
  Top 0.813: F1.2 R19.1
N$19
  Top 0.305: CON2.07 45.73,46.01 R24.2
N$20
  Top 0.305: OK2.3 42.37,34.14 R32.1
N$21
  Top 0.305: OK2.1 44.91,34.12 R31.1
N$22
  Top 0.305: U4.12 52.97,33.57 C14.2
  pour Top (no thermals): 53.75,33.75 53.75,39.5 53,39.5 53,33.75
SCL1  (via drill 0.3, 0.35)
  Top 0.305: v16,20.75 16,19.75 16.3,19.45 R9.1 18,19.25 19.75,17.5 24.25,17.5 25.15,16.6 IC2.13 | v16,27.25 16.53,26.72 U1.2
  Bottom 0.305: v16,27.25 v16,20.75
SCL1_ISO  (via drill 0.3)
  Top 0.305: R8.1 R1.1 11.97,48.25 v10.5,48.25 | U1.19 16.53,31.03 v16.25,30.75
  Bottom 0.305: v16.25,30.75 16.25,42.5 v10.5,48.25
SCL2  (via drill 0.3)
  Top 0.305: IC2.29 48,17.4 | R29.1 48,17.4 | 48,17.4 v48,18.75 | v48,27.25 48.53,26.72 U4.2
  Bottom 0.305: v48,18.75 v48,27.25
SCL2_ISO  (via drill 0.3)
  Top 0.305: R28.1 R23.1 43.98,48.25 v42.5,48.25 | U4.19 48.53,31.03 v48.25,30.75
  Bottom 0.305: v48.25,30.75 48.25,42.5 v42.5,48.25
SDA1  (via drill 0.3, 0.35)
  Top 0.305: IC2.27 31.2,15.8 v30,17 | v18.75,17 R10.1 | v17.25,27.25 17.16,27.16 U1.3
  Bottom 0.305: v30,17 v18.75,17 17.5,18.25 17.5,27 v17.25,27.25
SDA1_ISO  (via drill 0.3)
  Top 0.305: R7.1 R2.1 15.72,48.23 v15.75,48.25 | U1.18 17.16,31.09 v17.5,30.75
  Bottom 0.305: v17.5,30.75 17.5,46.5 v15.75,48.25
SDA2  (via drill 0.3)
  Top 0.305: IC2.30 45.7,18.2 47.5,20 R30.1 49.25,20.15 v49.25,21.5 | v49.25,27.25 49.16,27.16 U4.3
  Bottom 0.305: v49.25,27.25 v49.25,21.5
SDA2_ISO  (via drill 0.3)
  Top 0.305: R27.1 R24.1 46.27,48.25 v47.75,48.25 | U4.18 49.16,31.09 v49.5,30.75
  Bottom 0.305: v49.5,30.75 49.5,46.5 v47.75,48.25
STATUS_BAD
  Top 0.305: IC2.26 57.08,15 LED1.C1
STATUS_GOOD
  Top 0.305: IC2.25 56.05,14.2 56.25,14 57.08,14 LED1.C2
SWCLK
  Top 0.305: IC2.24 33.05,11.7 33.25,11.5 36,11.5 39.02,8.48 J3.4
SWDIO
  Top 0.305: IC2.23 32.25,11.5 33,10.75 35.25,10.75 38.79,7.21 J3.2
USB_DM
  Top 0.254: IC2.21 30.65,11.97 30.42,11.74 30.42,11.26 30.5,11.18 U3.6
USB_DP
  Top 0.254: IC2.22 31.45,11.87 31.58,11.74 31.58,11.26 31.5,11.18 U3.4
VARIANT0
  Top 0.305: IC2.14 23.55,15.8 R36.2
VARIANT1
  Top 0.305: IC2.15 24.6,15 23.6,14 R35.2
VBUS  (via drill 0.35)
  Top 0.254: IC1.5 R19.2
  Top 0.305: C4.1 7.8,11.45 R21.1 | U4.9 52.97,23.95 C17.2 | U1.9 20.97,23.95 C12.2 21,23.52 21,21.98 C11.2 | U2.3 11.95,11.75 C1.1
  Top 0.406: R19.2 14.65,11.6 v14.65,12.9 | C17.2 53,23.52 53,21.98 C16.2 53,21.52 v53,20.25 | v19.5,21.75 C11.2
  Bottom 0.406: v53,20.25 53,7.25 49.5,3.75 33.25,3.75 | 33.25,3.75 18,3.75 14.65,7.1 v14.65,12.9 | v19.5,21.75 27.25,21.75 33.25,15.75 33.25,3.75
  pour Top (no thermals): 15,11 9.5,11 9.5,14 10.25,14 10.25,11.75 15,11.75
VBUS_IN  (via drill 0.3, 0.4)
  Top 0.254: U3.5 v31,11.5
  Top 0.508: J2.B4/A9 33.4,5.65 32.5,4.75 v31,4.75 29.5,4.75 28.6,5.65 J2.A4/B9 | v21,11.5 F1.1
  Bottom 0.406: v31,11.5 v31,4.75
  Bottom 0.508: v31,4.75 27.75,8 24.5,8 v21,11.5
VCC  (via drill 0.3, 0.35, 0.4)
  Top 0.305: C9.1 26.1,12.5 | v56,18.5 R12.2 | R13.2 v56,10.5 | J3.1 45.75,6.66 v45.75,5.75 | R33.2 R34.2 42.27,22.25 v41,22.25 | R17.2 R18.2 10.28,22.25 v9,22.25 | U4.4 49.8,24.05 C19.2 v51.25,23.75 | U1.4 17.8,24.05 C3.2 v19.25,23.75 | R29.2 50.5,17.25 v51.25,18 51.25,19.85 R30.2 | R10.2 15.25,17 14.4,17.85 R9.2 v13.25,19.25
  Top 0.406: IC2.17 27.2,12.5 26.1,12.5 | IC2.5 29.85,22.75 C7.1 29.75,23.35 29.75,24.65 C13.1 29.75,25.35 v29.75,26.25 | IC2.1 33.05,22.65 C10.1 33.75,23.35 v33.75,24.25 | C9.1 25.4,12.5 v24.5,12.5
  other vias: 8.75,17.5
  pour Bottom (rank 2): 0,28 0,3 arc90 3,0 59,0 arc90 62,3 62,28
  pour Top (no thermals): 8.3,15.5 8.3,18 9.25,18 9.25,16.5 10.25,16.5 10.25,15.5
VDDISO1  (via drill 0.3, 0.4)
  Top 0.305: U1.17 17.8,33.82 C2.2 v19.25,34 | R8.2 R7.2 14.28,51.5 v15.75,51.5
  Top 0.508: CON1.06 v15,38
  Top 0.813: CON1.05 CON1.06
  pour Bottom (rank 2): 0,57 0,30 30,30 30,60 3,60 arc90
VDDISO2  (via drill 0.3, 0.4)
  Top 0.305: U4.17 49.8,33.82 C18.2 v51.25,34 | R28.2 R27.2 46.27,51.5 v47.75,51.5
  Top 0.508: CON2.06 v47,38
  Top 0.813: CON2.05 CON2.06
  pour Bottom: 32,60 59,60 arc-90 62,57 62,30 32,30
VISO1
  Top 0.305: CON1.02 17.54,37.89 R5.2 16.35,37.6 14.6,35.85 R15.2 R16.2 | F2.1 17.64,40.85 17.54,40.75
  Top 0.813: CON1.01 17.54,40.75 CON1.02
  pour Top (no thermals): 21.88,41.25 17.5,41.25 17.5,40.5 21.88,40.5
VISO2
  Top 0.305: CON2.02 49.54,40 49.54,37.89 R25.2 48.35,37.6 46.6,35.85 R31.2 R32.2 | F3.1 49.89,40.85 49.54,40.5
  Top 0.813: CON2.01 49.54,40.5 49.54,40
  pour Top (no thermals): 53.75,41.25 53.75,40.5 49.5,40.5 49.5,41.25

### Text on the board
tStop: 1 | H-BRS | I2C Carrier | 1.1 | Marcel Hasler, 2022